# Altium schematic sheet WT2_Sensors.SchDoc
size A4
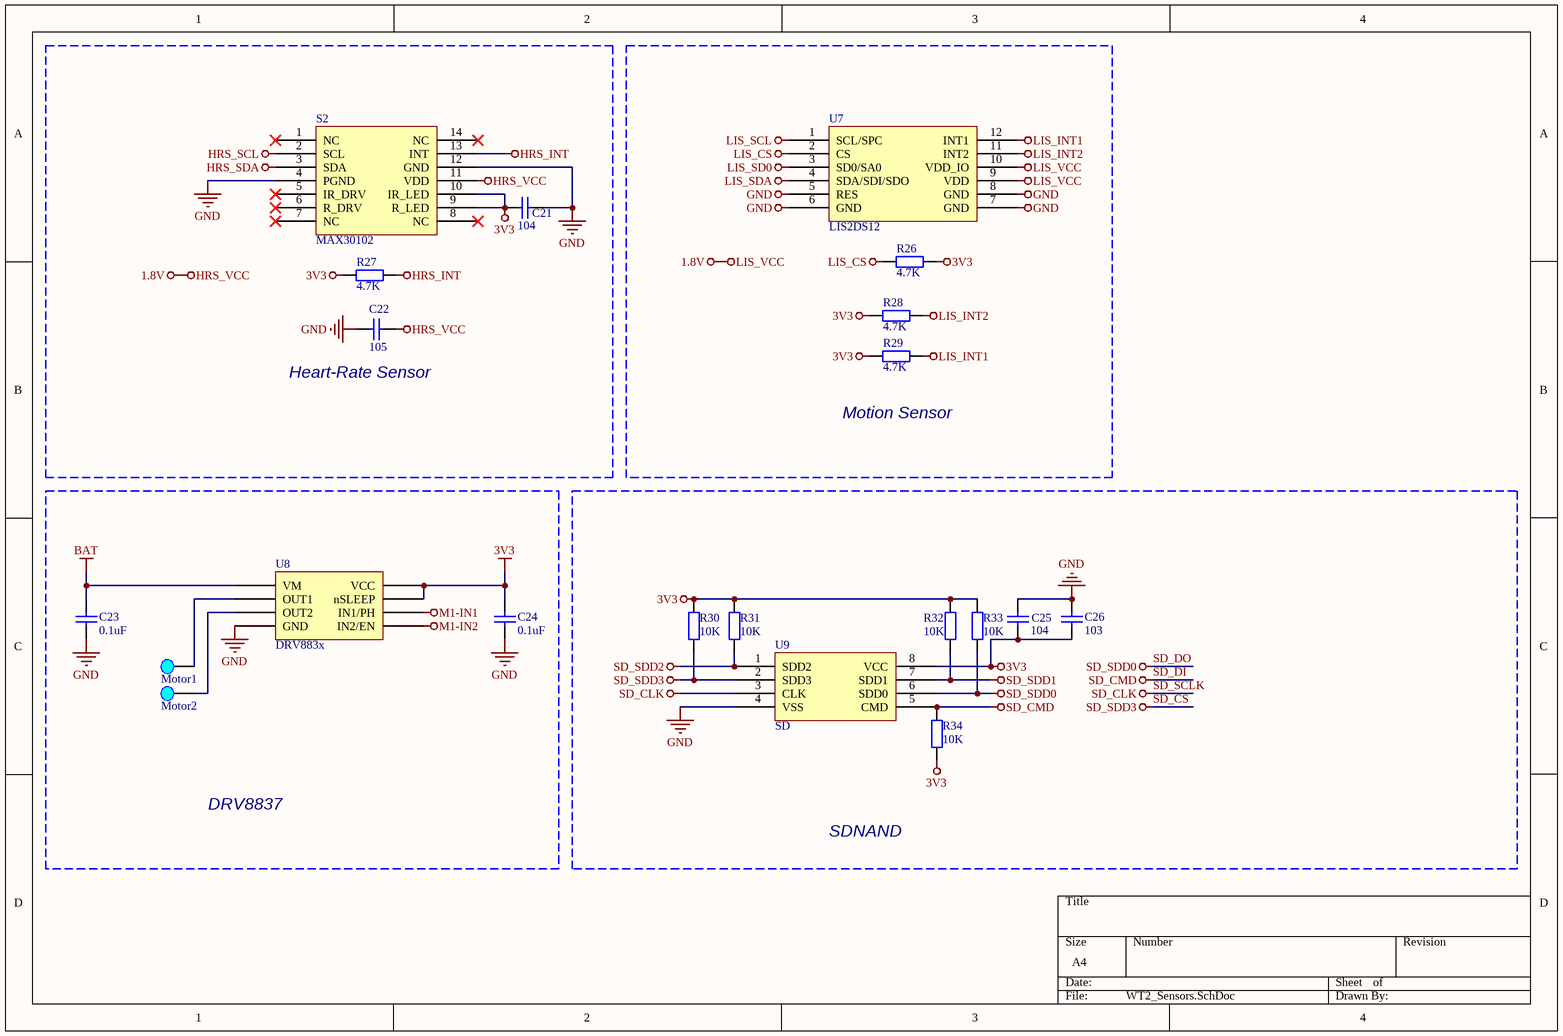
[diagram p0: WT2_Sensors.SchDoc]

## Parts
C21  104  [电容_C0402]
C22  105  [电容_C0402]
C23  0.1uF  [电容_C0402]
C24  0.1uF  [电容_C0402]
C25  104  [电容_C0402]
C26  103  [电容_C0402]
Pad7  Motor1  [Pad_A]
Pad8  Motor2  [Pad_A]
R26  4.7K  [电阻_R0402]
R27  4.7K  [电阻_R0402]
R28  4.7K  [电阻_R0402]
R29  4.7K  [电阻_R0402]
R30  10K  [电阻_R0402]
R31  10K  [电阻_R0402]
R32  10K  [电阻_R0402]
R33  10K  [电阻_R0402]
R34  10K  [电阻_R0402]
S2  MAX30102  [MAX30102]
U7  LIS2DS12  [LGA-12_2*2mm]
U8  DRV883x  [WSON-8_2*2]
U9  SD  [LGA-8_6*8mm2]

## Blocks framed on the sheet
Heart-Rate Sensor: C21 C22 R27 S2
Motion Sensor: R26 R28 R29 U7
DRV8837: C23 C24 Pad7 Pad8 U8
SDNAND: C25 C26 R30-R34 U9

## Nets
1.8V: C22.1 S2.11(VDD) U7.9(VDD) U7.10(VDD_IO)  [also labelled HRS_VCC, LIS_VCC]
3V3: C21.2 C24.2 C25.1 C26.1 R26.1 R27.2 R28.2 R29.2 R30.1 R31.1 R32.1 R33.1 R34.2 S2.9(R_LED) S2.10(IR_LED) U8.7(nSLEEP) U8.8(VCC) U9.8(VCC)
BAT: C23.1 U8.1(VM)
GND: C21.1 C22.2 C23.2 C24.1 C25.2 C26.2 S2.4(PGND) S2.12(GND) U7.5(RES) U7.6(GND) U7.7(GND) U7.8(GND) U8.4(GND) U9.4(VSS)
HRS_INT: R27.1 S2.13(INT)
HRS_SCL: S2.2(SCL)
HRS_SDA: S2.3(SDA)
LIS_CS: R26.2 U7.2(CS)
LIS_INT1: R29.1 U7.12(INT1)
LIS_INT2: R28.1 U7.11(INT2)
LIS_SCL: U7.1(SCL/SPC)
LIS_SD0: U7.3(SD0/SA0)
LIS_SDA: U7.4(SDA/SDI/SDO)
M1-IN1: U8.6(IN1/PH)
M1-IN2: U8.5(IN2/EN)
SD_CS: R30.2 U9.2(SDD3)  [also labelled SD_SDD3]
SD_DI: R34.1 U9.5(CMD)  [also labelled SD_CMD]
SD_DO: R33.2 U9.6(SDD0)  [also labelled SD_SDD0]
SD_SCLK: U9.3(CLK)  [also labelled SD_CLK]
SD_SDD1: R32.2 U9.7(SDD1)
SD_SDD2: R31.2 U9.1(SDD2)
NetPad7_1: Pad7.1 U8.2(OUT1)
NetPad8_1: Pad8.1 U8.3(OUT2)

Not connected (* = marked no-connect by the designer): S2 1(NC)* 5(IR_DRV)* 6(R_DRV)* 7(NC)* 8(NC)* 14(NC)*

## Library data of the parts
C21-C26 = cap: U: 50V; 参数: Cap,0805,X7R,104K,50V,125C,±10%
  C21 C25: C: 104
  C22: C: 105
  C23 C24: C: 0.1uF
  C26: C: 103
Pad7 = Pad: _Funcyusa: Test; _Specification: Pad,Test,Motor1; _Comma: ,; _Name: Pad; _Remarks: Motor1
Pad8 = Pad: _Funcyusa: Test; _Specification: Pad,Test,Motor2; _Comma: ,; _Name: Pad; _Remarks: Motor2
R26-R34 = Res: P: 1/8W; 参数: Res,0805,0R,±1%,1/8W,100ppm,155C
  R26-R29: R: 4.7K
  R30-R34: R: 10K
S2 = MAX30102: 血氧浓度传感器
U7 = LIS2DS12: 运动传感器
U9 = SDNAND